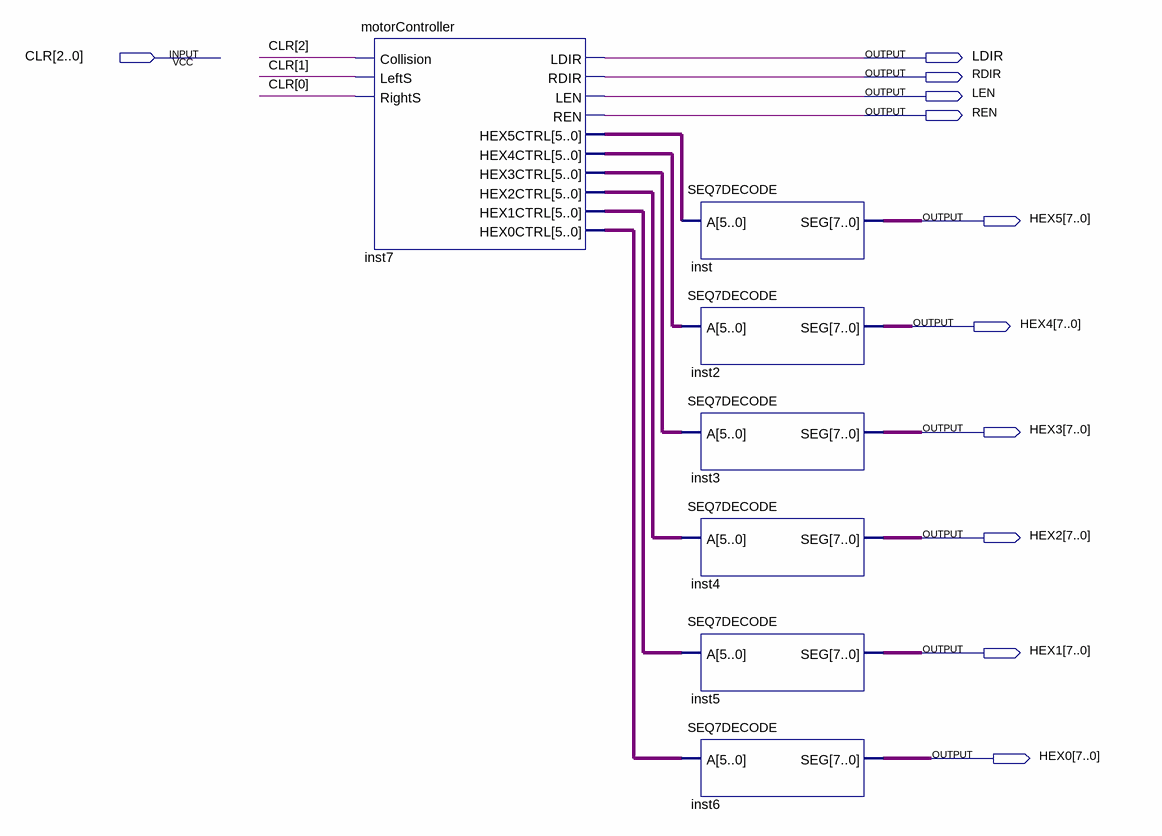
[diagram p0: schematic sheet]
// Quartus schematic lab8.bdf as structural Verilog: 7 symbols, 11 pins
module lab8 (
  input  [2:0] CLR,
  output LDIR,
  output RDIR,
  output LEN,
  output REN,
  output [7:0] HEX5,
  output [7:0] HEX4,
  output [7:0] HEX3,
  output [7:0] HEX2,
  output [7:0] HEX1,
  output [7:0] HEX0
);

  wire [5:0] inst7_hex0ctrl, inst7_hex1ctrl, inst7_hex2ctrl, inst7_hex3ctrl, inst7_hex4ctrl, inst7_hex5ctrl;

  motorController inst7 (
    .Collision(CLR[2]), .LeftS(CLR[1]), .RightS(CLR[0]), .LDIR(LDIR), .RDIR(RDIR), .LEN(LEN), .REN(REN),
    .HEX5CTRL(inst7_hex5ctrl), .HEX4CTRL(inst7_hex4ctrl), .HEX3CTRL(inst7_hex3ctrl),
    .HEX2CTRL(inst7_hex2ctrl), .HEX1CTRL(inst7_hex1ctrl), .HEX0CTRL(inst7_hex0ctrl));
  SEQ7DECODE inst (.A(inst7_hex5ctrl), .SEG(HEX5));
  SEQ7DECODE inst2 (.A(inst7_hex4ctrl), .SEG(HEX4));
  SEQ7DECODE inst3 (.A(inst7_hex3ctrl), .SEG(HEX3));
  SEQ7DECODE inst4 (.A(inst7_hex2ctrl), .SEG(HEX2));
  SEQ7DECODE inst5 (.A(inst7_hex1ctrl), .SEG(HEX1));
  SEQ7DECODE inst6 (.A(inst7_hex0ctrl), .SEG(HEX0));
endmodule
